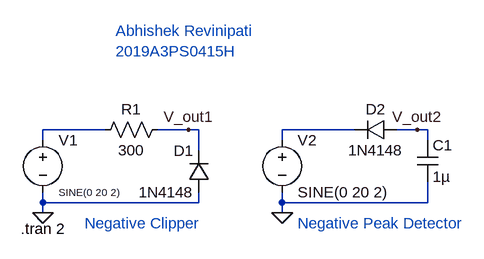
[diagram p0: schematic 2019A3PS0415H_3.asc]
2019A3PS0415H_3.asc, the LTspice schematic file:
Version 4
SHEET 1 880 680
WIRE 128 96 32 96
WIRE 256 96 208 96
WIRE 272 96 256 96
WIRE 512 96 400 96
WIRE 608 96 576 96
WIRE 624 96 608 96
WIRE 32 112 32 96
WIRE 400 112 400 96
WIRE 624 112 624 96
WIRE 272 128 272 96
WIRE 32 208 32 192
WIRE 272 208 272 192
WIRE 272 208 32 208
WIRE 400 208 400 192
WIRE 624 208 624 176
WIRE 624 208 400 208
WIRE 32 224 32 208
WIRE 400 224 400 208
FLAG 32 224 0
FLAG 256 96 V_out1
FLAG 400 224 0
FLAG 608 96 V_out2
SYMBOL voltage 32 96 R0
WINDOW 3 24 96 Left 1
WINDOW 123 0 0 Left 0
WINDOW 39 0 0 Left 0
SYMATTR InstName V1
SYMATTR Value SINE(0 20 2)
SYMBOL res 224 80 R90
WINDOW 0 0 56 VBottom 2
WINDOW 3 32 56 VTop 2
SYMATTR InstName R1
SYMATTR Value 300
SYMBOL diode 288 192 R180
WINDOW 0 24 64 Left 2
WINDOW 3 24 0 Left 2
SYMATTR InstName D1
SYMATTR Value 1N4148
SYMBOL voltage 400 96 R0
WINDOW 123 0 0 Left 0
WINDOW 39 0 0 Left 0
SYMATTR InstName V2
SYMATTR Value SINE(0 20 2)
SYMBOL diode 576 80 R90
WINDOW 0 0 32 VBottom 2
WINDOW 3 32 32 VTop 2
SYMATTR InstName D2
SYMATTR Value 1N4148
SYMBOL cap 608 112 R0
SYMATTR InstName C1
SYMATTR Value 1µ
TEXT -2 248 Left 2 !.tran 2
TEXT 144 -56 Left 2 ;Abhishek Revinipati\n2019A3PS0415H
TEXT 96 240 Left 2 ;Negative Clipper
TEXT 424 240 Left 2 ;Negative Peak Detector

The netlist it stands for:
* 2019A3PS0415H_3.asc
V1 N001 0 SINE(0 20 2)
R1 V_out1 N001 300
D1 0 V_out1 1N4148
V2 N002 0 SINE(0 20 2)
D2 V_out2 N002 1N4148
C1 V_out2 0 1µ
.model D D
.lib standard.dio
.tran 2
* Abhishek Revinipati
* 2019A3PS0415H
* Negative Clipper
* Negative Peak Detector
.backanno
.end